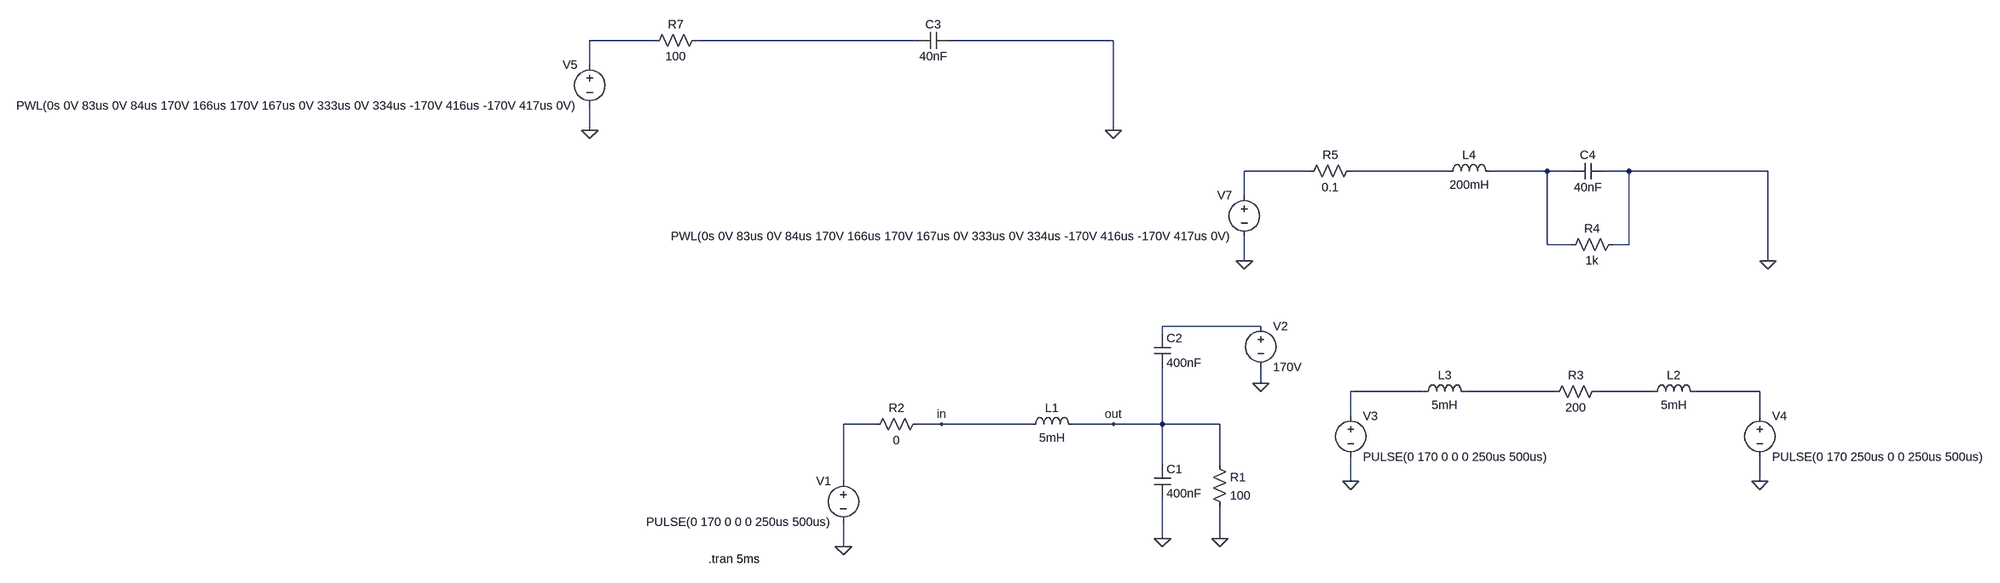
[diagram p0: schematic FilterTest.asc]
FilterTest.asc, the LTspice schematic file:
Version 4
SHEET 1 2208 680
WIRE -432 -912 -560 -912
WIRE 80 -912 -352 -912
WIRE 464 -912 144 -912
WIRE -560 -864 -560 -912
WIRE -560 -736 -560 -784
WIRE 464 -736 464 -912
WIRE 848 -656 720 -656
WIRE 1120 -656 928 -656
WIRE 1312 -656 1200 -656
WIRE 1360 -656 1312 -656
WIRE 1472 -656 1424 -656
WIRE 1744 -656 1472 -656
WIRE 720 -608 720 -656
WIRE 1312 -512 1312 -656
WIRE 1360 -512 1312 -512
WIRE 1472 -512 1472 -656
WIRE 1472 -512 1440 -512
WIRE 720 -480 720 -528
WIRE 1744 -480 1744 -656
WIRE 752 -192 560 -192
WIRE 560 -176 560 -192
WIRE 752 -80 752 -112
WIRE 1072 -64 928 -64
WIRE 1328 -64 1152 -64
WIRE 1520 -64 1408 -64
WIRE 1728 -64 1600 -64
WIRE 928 -16 928 -64
WIRE 1728 -16 1728 -64
WIRE 0 0 -64 0
WIRE 128 0 80 0
WIRE 304 0 128 0
WIRE 464 0 384 0
WIRE 560 0 560 -112
WIRE 560 0 464 0
WIRE 672 0 560 0
WIRE 560 80 560 0
WIRE 672 80 672 0
WIRE -64 112 -64 0
WIRE 928 112 928 64
WIRE 1728 112 1728 64
WIRE 560 224 560 144
WIRE 672 224 672 160
WIRE -64 240 -64 192
FLAG -64 240 0
FLAG 672 224 0
FLAG 128 0 in
FLAG 464 0 out
FLAG 560 224 0
FLAG 752 -80 0
FLAG 928 112 0
FLAG 1728 112 0
FLAG 720 -480 0
FLAG 1744 -480 0
FLAG -560 -736 0
FLAG 464 -736 0
SYMBOL voltage -64 96 M0
WINDOW 123 0 0 Left 0
WINDOW 39 0 0 Left 0
SYMATTR InstName V1
SYMATTR Value PULSE(0 170 0 0 0 250us 500us)
SYMBOL ind 288 16 R270
WINDOW 0 32 56 VTop 2
WINDOW 3 5 56 VBottom 2
SYMATTR InstName L1
SYMATTR Value 5mH
SYMBOL res 656 64 R0
SYMATTR InstName R1
SYMATTR Value 100
SYMBOL cap 544 80 R0
SYMATTR InstName C1
SYMATTR Value 400nF
SYMBOL res 96 -16 R90
WINDOW 0 0 56 VBottom 2
WINDOW 3 32 56 VTop 2
SYMATTR InstName R2
SYMATTR Value 0
SYMBOL voltage 752 -208 R0
WINDOW 123 0 0 Left 0
WINDOW 39 0 0 Left 0
SYMATTR InstName V2
SYMATTR Value 170V
SYMBOL cap 544 -176 R0
SYMATTR InstName C2
SYMATTR Value 400nF
SYMBOL voltage 928 -32 R0
WINDOW 123 0 0 Left 0
WINDOW 39 0 0 Left 0
SYMATTR InstName V3
SYMATTR Value PULSE(0 170 0 0 0 250us 500us)
SYMBOL voltage 1728 -32 R0
WINDOW 123 0 0 Left 0
WINDOW 39 0 0 Left 0
SYMATTR InstName V4
SYMATTR Value PULSE(0 170 250us 0 0 250us 500us)
SYMBOL ind 1504 -48 R270
WINDOW 0 32 56 VTop 2
WINDOW 3 5 56 VBottom 2
SYMATTR InstName L2
SYMATTR Value 5mH
SYMBOL res 1424 -80 R90
WINDOW 0 0 56 VBottom 2
WINDOW 3 32 56 VTop 2
SYMATTR InstName R3
SYMATTR Value 200
SYMBOL ind 1056 -48 R270
WINDOW 0 32 56 VTop 2
WINDOW 3 5 56 VBottom 2
SYMATTR InstName L3
SYMATTR Value 5mH
SYMBOL voltage 720 -624 M0
WINDOW 123 0 0 Left 0
WINDOW 39 0 0 Left 0
SYMATTR InstName V7
SYMATTR Value PWL(0s 0V 83us 0V 84us 170V 166us 170V 167us 0V 333us 0V 334us -170V 416us -170V 417us 0V)
SYMBOL cap 1424 -672 R90
WINDOW 0 0 32 VBottom 2
WINDOW 3 32 32 VTop 2
SYMATTR InstName C4
SYMATTR Value 40nF
SYMBOL ind 1104 -640 R270
WINDOW 0 32 56 VTop 2
WINDOW 3 5 56 VBottom 2
SYMATTR InstName L4
SYMATTR Value 200mH
SYMBOL res 1456 -528 R90
WINDOW 0 0 56 VBottom 2
WINDOW 3 32 56 VTop 2
SYMATTR InstName R4
SYMATTR Value 1k
SYMBOL res 944 -672 R90
WINDOW 0 0 56 VBottom 2
WINDOW 3 32 56 VTop 2
SYMATTR InstName R5
SYMATTR Value 0.1
SYMBOL voltage -560 -880 M0
WINDOW 123 0 0 Left 0
WINDOW 39 0 0 Left 0
SYMATTR InstName V5
SYMATTR Value PWL(0s 0V 83us 0V 84us 170V 166us 170V 167us 0V 333us 0V 334us -170V 416us -170V 417us 0V)
SYMBOL cap 144 -928 R90
WINDOW 0 0 32 VBottom 2
WINDOW 3 32 32 VTop 2
SYMATTR InstName C3
SYMATTR Value 40nF
SYMBOL res -336 -928 R90
WINDOW 0 0 56 VBottom 2
WINDOW 3 32 56 VTop 2
SYMATTR InstName R7
SYMATTR Value 100
TEXT -328 264 Left 2 !.tran 5ms

The netlist it stands for:
* FilterTest.asc
V1 N011 0 PULSE(0 170 0 0 0 250us 500us)
L1 in out 5mH
R1 out 0 100
C1 out 0 400nF
R2 in N011 0
V2 N006 0 170V
C2 N006 out 400nF
V3 N007 0 PULSE(0 170 0 0 0 250us 500us)
V4 N010 0 PULSE(0 170 250us 0 0 250us 500us)
L2 N009 N010 5mH
R3 N009 N008 200
L3 N007 N008 5mH
V7 N003 0 PWL(0s 0V 83us 0V 84us 170V 166us 170V 167us 0V 333us 0V 334us -170V 416us -170V 417us 0V)
C4 0 N005 40nF
L4 N004 N005 200mH
R4 0 N005 1k
R5 N004 N003 0.1
V5 N001 0 PWL(0s 0V 83us 0V 84us 170V 166us 170V 167us 0V 333us 0V 334us -170V 416us -170V 417us 0V)
C3 0 N002 40nF
R7 N002 N001 100
.tran 5ms
.backanno
.end